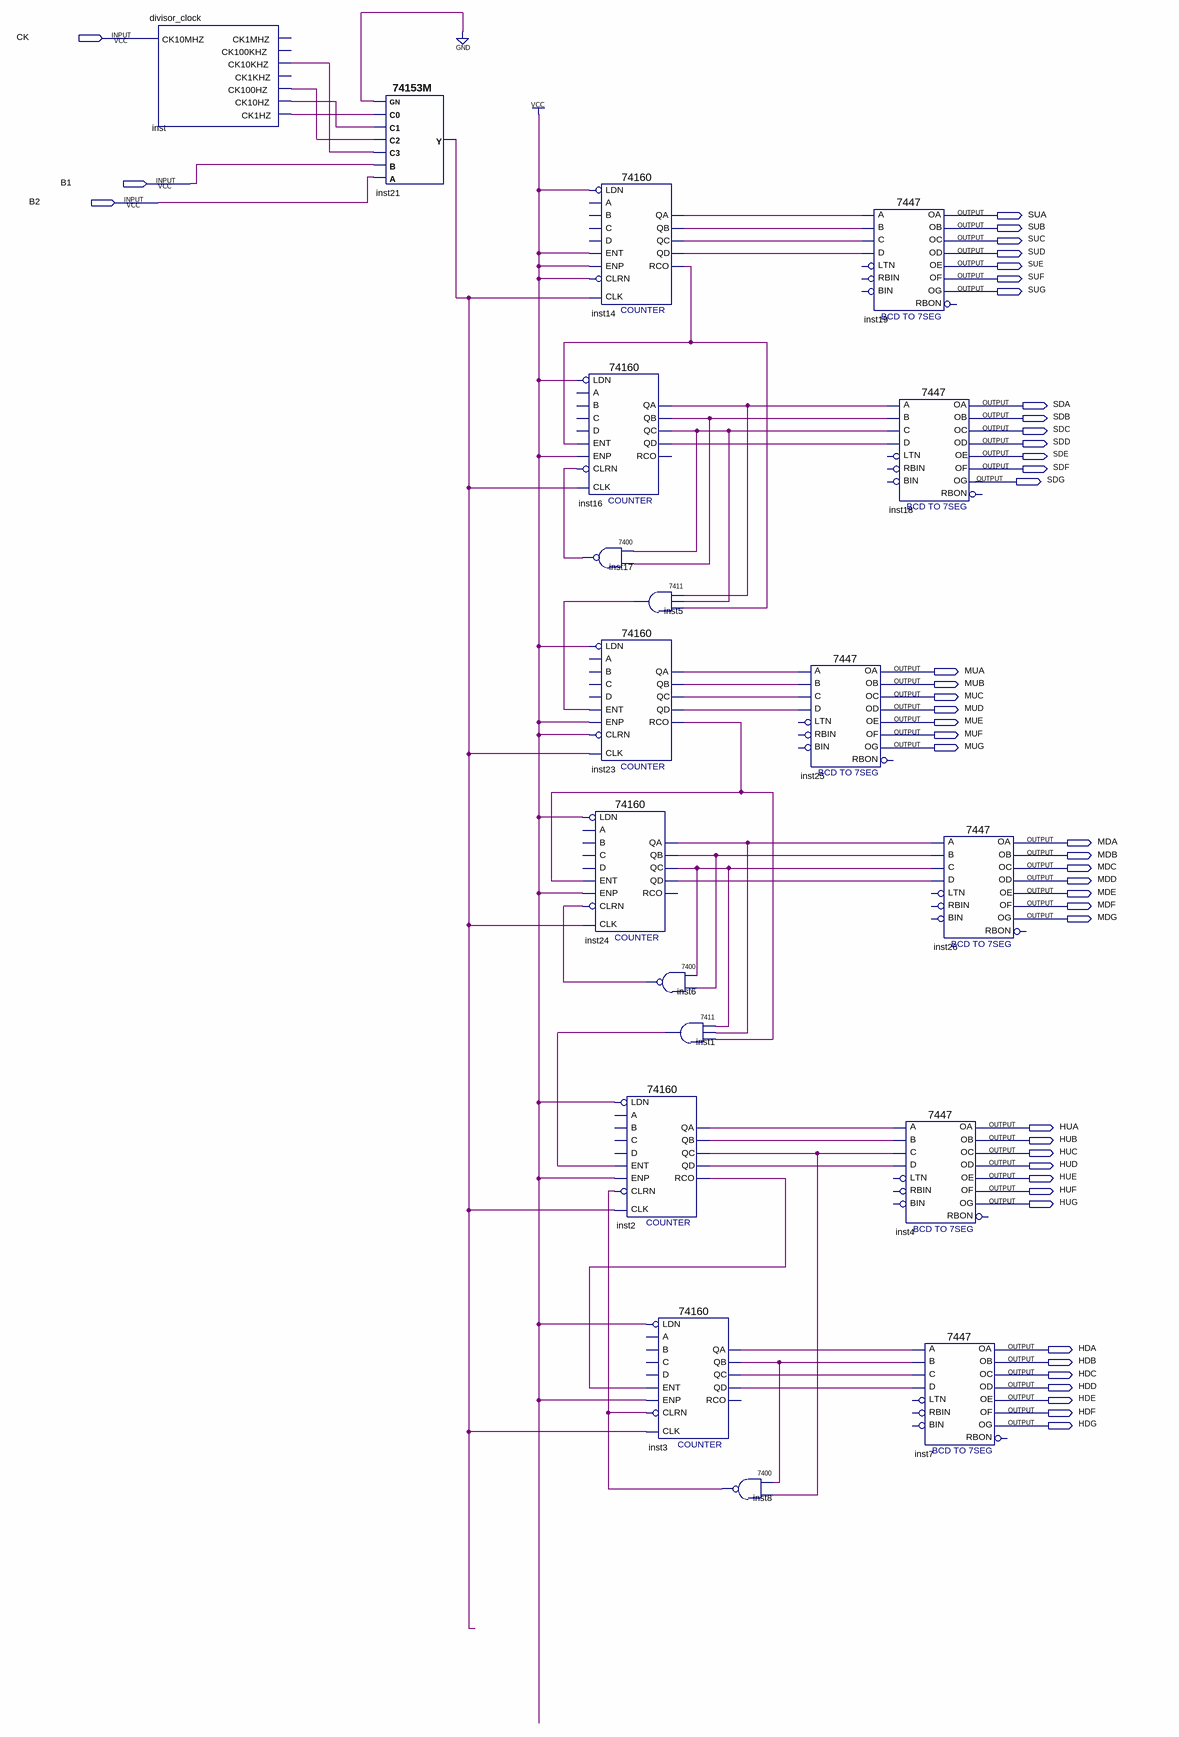
[diagram p0: schematic sheet]
// Quartus schematic relogio.bdf as structural Verilog: 19 symbols, 45 pins
module relogio (
  input  CK,
  input  B1,
  input  B2,
  output SUA,
  output SUB,
  output SUC,
  output SUD,
  output SUE,
  output SUF,
  output SUG,
  output SDA,
  output SDB,
  output SDC,
  output SDD,
  output SDE,
  output SDF,
  output SDG,
  output MUA,
  output MUB,
  output MUC,
  output MUD,
  output MUE,
  output MUF,
  output MUG,
  output MDA,
  output MDB,
  output MDC,
  output MDD,
  output MDE,
  output MDF,
  output MDG,
  output HUA,
  output HUB,
  output HUC,
  output HUD,
  output HUE,
  output HUF,
  output HUG,
  output HDA,
  output HDB,
  output HDC,
  output HDD,
  output HDE,
  output HDF,
  output HDG
);

  wire inst1_1, inst2_qa, inst2_qb, inst2_qc, inst2_qd, inst2_rco, inst3_qa, inst3_qb, inst3_qc, inst3_qd,
       inst5_1, inst6_1, inst8_1, inst14_qa, inst14_qb, inst14_qc, inst14_qd, inst14_rco, inst16_qa,
       inst16_qb, inst16_qc, inst16_qd, inst17_1, inst21_y, inst23_qa, inst23_qb, inst23_qc, inst23_qd,
       inst23_rco, inst24_qa, inst24_qb, inst24_qc, inst24_qd, inst_ck1hz, inst_ck10hz, inst_ck10khz,
       inst_ck100hz;

  divisor_clock inst (
    .CK10MHZ(CK), .CK10KHZ(inst_ck10khz), .CK100HZ(inst_ck100hz), .CK10HZ(inst_ck10hz), .CK1HZ(inst_ck1hz));  // open: CK1MHZ, CK100KHZ, CK1KHZ
  \74153M  inst21 (
    .A(B2), .B(B1), .C3(inst_ck10khz), .C2(inst_ck100hz), .C1(inst_ck10hz), .C0(inst_ck1hz), .GN(1'b0),
    .Y(inst21_y));
  \74160  inst16 (
    .CLK(inst21_y), .ENT(inst14_rco), .LDN(1'b1), .ENP(1'b1), .CLRN(inst17_1), .QD(inst16_qd),
    .QA(inst16_qa), .QB(inst16_qb), .QC(inst16_qc));  // open: A, B, C, D, RCO
  \74160  inst14 (
    .CLK(inst21_y), .ENT(1'b1), .LDN(1'b1), .ENP(1'b1), .CLRN(1'b1), .QD(inst14_qd), .QA(inst14_qa),
    .QB(inst14_qb), .QC(inst14_qc), .RCO(inst14_rco));  // open: A, B, C, D
  \7400  inst17 (.\3 (inst16_qb), .\2 (inst16_qc), .\1 (inst17_1));
  \74160  inst23 (
    .CLK(inst21_y), .ENT(inst5_1), .LDN(1'b1), .ENP(1'b1), .CLRN(1'b1), .QD(inst23_qd), .QA(inst23_qa),
    .QB(inst23_qb), .QC(inst23_qc), .RCO(inst23_rco));  // open: A, B, C, D
  \74160  inst24 (
    .CLK(inst21_y), .ENT(inst23_rco), .LDN(1'b1), .ENP(1'b1), .CLRN(inst6_1), .QD(inst24_qd), .QA(inst24_qa),
    .QB(inst24_qb), .QC(inst24_qc));  // open: A, B, C, D, RCO
  \74160  inst2 (
    .CLK(inst21_y), .ENT(inst1_1), .LDN(1'b1), .ENP(1'b1), .CLRN(inst8_1), .QD(inst2_qd), .QA(inst2_qa),
    .QB(inst2_qb), .QC(inst2_qc), .RCO(inst2_rco));  // open: A, B, C, D
  \7411  inst5 (.\2 (inst16_qa), .\3 (inst16_qc), .\4 (inst14_rco), .\1 (inst5_1));
  \7400  inst6 (.\3 (inst24_qb), .\2 (inst24_qc), .\1 (inst6_1));
  \7411  inst1 (.\2 (inst24_qc), .\3 (inst24_qa), .\4 (inst23_rco), .\1 (inst1_1));
  \74160  inst3 (
    .CLK(inst21_y), .ENT(inst2_rco), .LDN(1'b1), .ENP(1'b1), .CLRN(inst8_1), .QD(inst3_qd), .QA(inst3_qa),
    .QB(inst3_qb), .QC(inst3_qc));  // open: A, B, C, D, RCO
  \7400  inst8 (.\3 (inst2_qc), .\2 (inst3_qb), .\1 (inst8_1));
  \7447  inst25 (
    .B(inst23_qb), .C(inst23_qc), .D(inst23_qd), .A(inst23_qa), .OB(MUB), .OC(MUC), .OE(MUE), .OD(MUD),
    .OF(MUF), .OG(MUG), .OA(MUA));  // open: LTN, RBIN, BIN, RBON
  \7447  inst19 (
    .B(inst14_qb), .C(inst14_qc), .D(inst14_qd), .A(inst14_qa), .OB(SUB), .OC(SUC), .OE(SUE), .OD(SUD),
    .OF(SUF), .OG(SUG), .OA(SUA));  // open: LTN, RBIN, BIN, RBON
  \7447  inst18 (
    .B(inst16_qb), .C(inst16_qc), .D(inst16_qd), .A(inst16_qa), .OB(SDB), .OC(SDC), .OE(SDE), .OD(SDD),
    .OF(SDF), .OG(SDG), .OA(SDA));  // open: LTN, RBIN, BIN, RBON
  \7447  inst26 (
    .B(inst24_qb), .C(inst24_qc), .D(inst24_qd), .A(inst24_qa), .OB(MDB), .OC(MDC), .OE(MDE), .OD(MDD),
    .OF(MDF), .OG(MDG), .OA(MDA));  // open: LTN, RBIN, BIN, RBON
  \7447  inst4 (
    .B(inst2_qb), .C(inst2_qc), .D(inst2_qd), .A(inst2_qa), .OB(HUB), .OC(HUC), .OE(HUE), .OD(HUD), .OF(HUF),
    .OG(HUG), .OA(HUA));  // open: LTN, RBIN, BIN, RBON
  \7447  inst7 (
    .B(inst3_qb), .C(inst3_qc), .D(inst3_qd), .A(inst3_qa), .OB(HDB), .OC(HDC), .OE(HDE), .OD(HDD), .OF(HDF),
    .OG(HDG), .OA(HDA));  // open: LTN, RBIN, BIN, RBON
endmodule
